# Altium schematic sheet FPGA.SchDoc
size A2; PageSetup: Record=PageOptions|CenterHorizontal=True|CenterVertical=True|PrintScale=0.70|XCorrection=1.00|YCorrection=1.00|PrintKind=1|BorderSize=5000000|LeftOffset=0|BottomOffset=0|Orientation=2|PaperLength=2970|PaperWidth=2100|Scale=100|PaperSource=1|PrintQuality=600|MediaType=1|DitherType=10|PaperKind=A4|PrintScaleMode=1
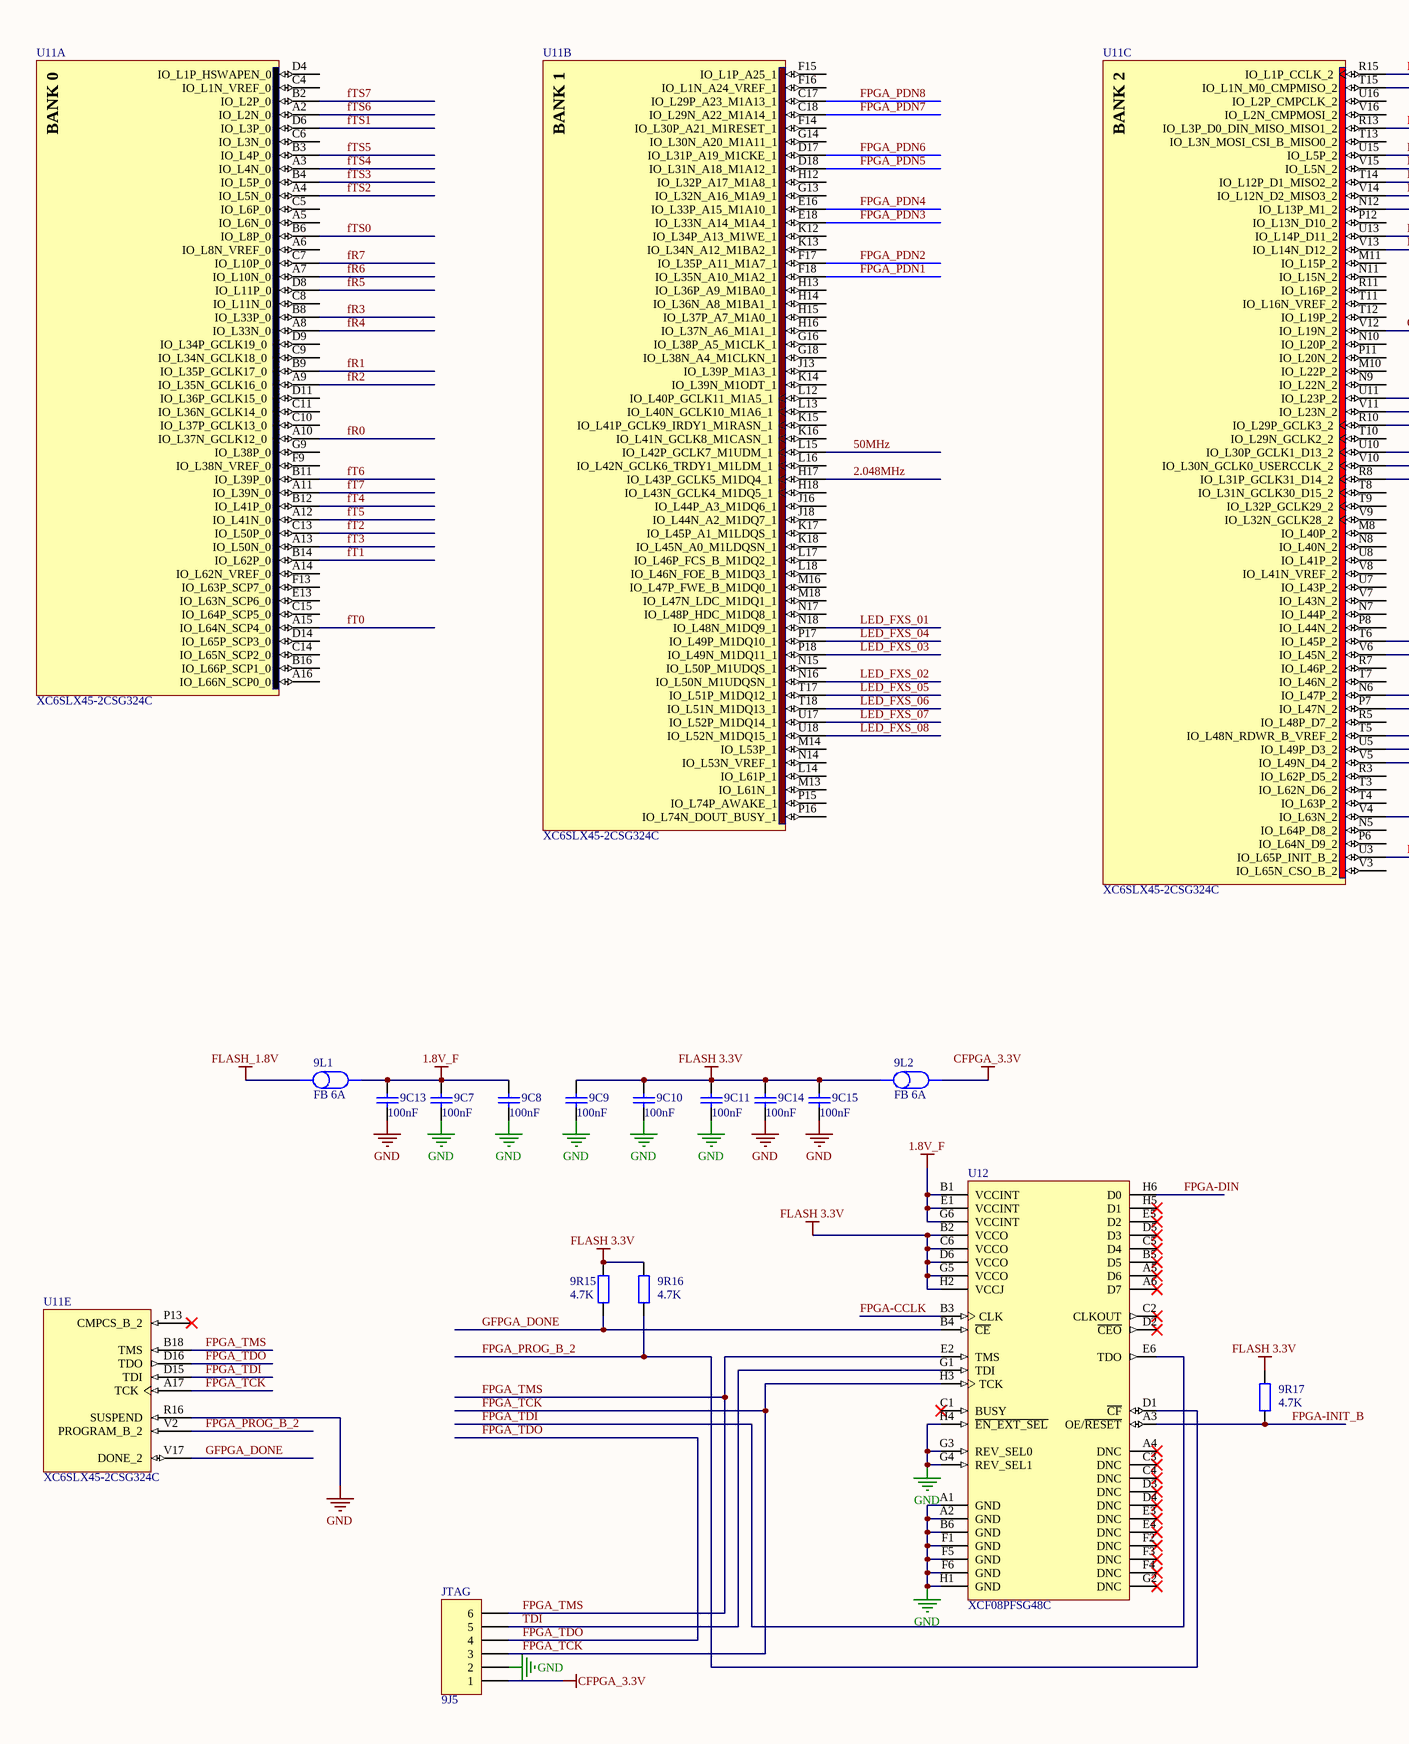
[diagram p0: FPGA.SchDoc, left]
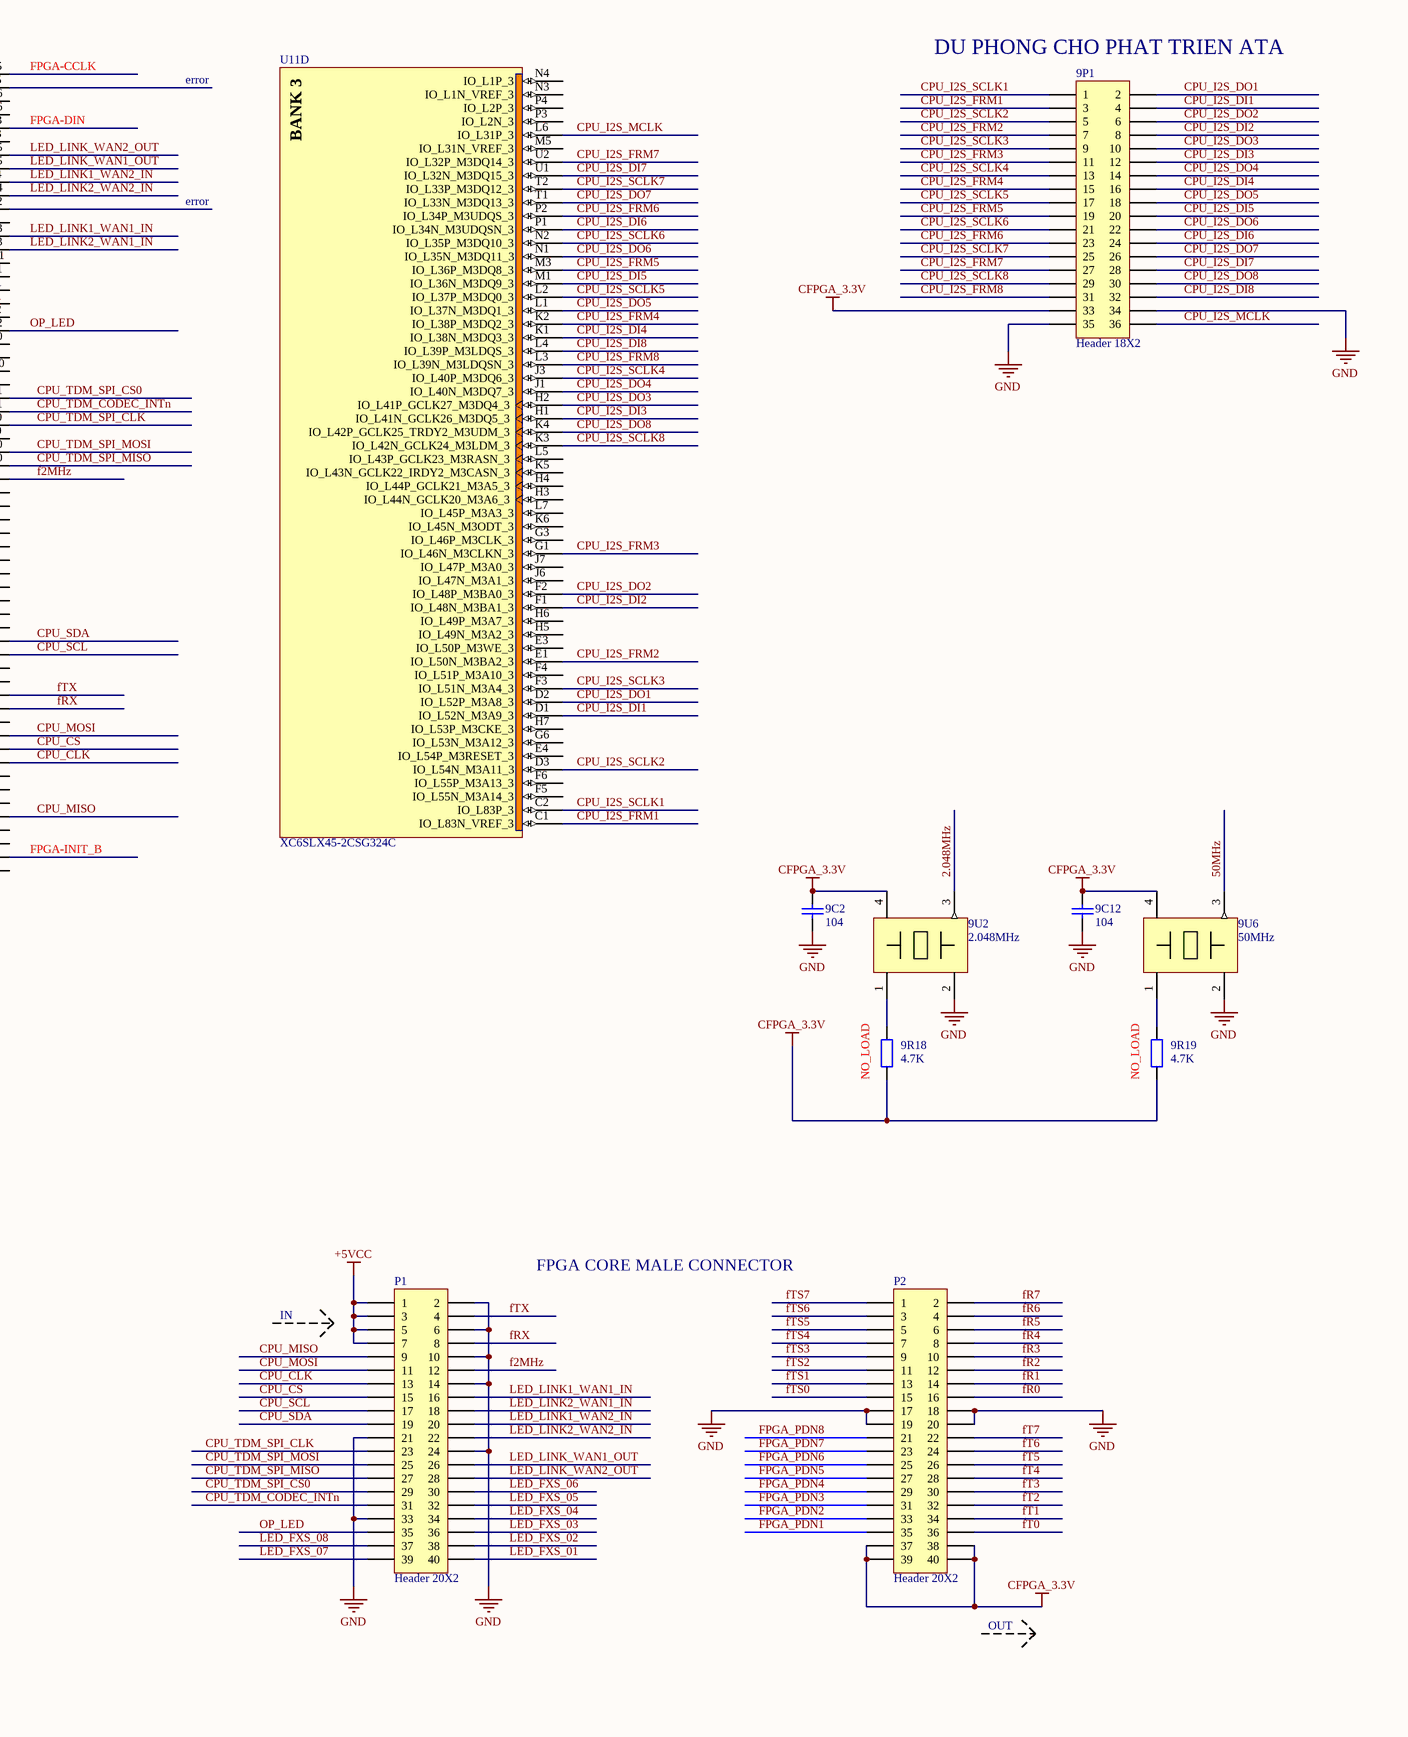
[diagram p1: FPGA.SchDoc, right]

## Parts
9C2  CAP: 104  [0805C]  (hidden comment: CAP1)
9C7  100nF  [C0402]
9C8  100nF  [C0402]
9C9  100nF  [C0402]
9C10  100nF  [C0402]
9C11  100nF  [C0402]
9C12  CAP: 104  [0805C]  (hidden comment: CAP1)
9C13  100nF  [C0402]
9C14  100nF  [C0402]
9C15  100nF  [C0402]
9J5  JTAG  [HDR 1X6]
9L1  FB 6A  [0805]
9L2  FB 6A  [0805]
9P1  Header 18X2  [HDR2X18]
9R15  4.7K  [0603_1]
9R16  4.7K  [0603_1]
9R17  4.7K  [0603_1]
9R18  4.7K  LOAD: NO_LOAD  [0603_1]
9R19  4.7K  LOAD: NO_LOAD  [0603_1]
9U2  2.048MHz  [CB3LV-3I-2M0480]
9U6  50MHz  [CB3LV-3I-2M0480]
P1  Header 20X2  [HEADER 40P MALE]
P2  Header 20X2  [HEADER 40P MALE]
U11  XC6SLX45-2CSG324C  [CSG324]  (parts A,B,C,D,E of 8)
U12  XCF08PFSG48C  [XCF08PFSG48C]

## Nets
1.8V_F: 9C7.2 9C8.2 9C13.2 9L1.1 U12.B1(VCCINT) U12.E1(VCCINT) U12.G6(VCCINT)
+5VCC: P1.1 P1.3 P1.5 P1.7
CFPGA_3.3V: 9C2.2 9C12.2 9J5.1 9L2.1 9P1.33 9R18.1 9R19.1 9U2.4 9U6.4 P2.37 P2.38 P2.39 P2.40
FLASH 3.3V: 9C9.2 9C10.2 9C11.2 9C14.2 9C15.2 9L2.2 9R15.2 9R16.2 9R17.2 U12.B2(VCCO) U12.C6(VCCO) U12.D6(VCCO) U12.G5(VCCO) U12.H2(VCCJ)
FLASH_1.8V: 9L1.2
GND: 9C2.1 9C7.1 9C8.1 9C9.1 9C10.1 9C11.1 9C12.1 9C13.1 9C14.1 9C15.1 9J5.2 9P1.34 9P1.35 9U2.2 9U6.2 P1.2 P1.6 P1.10 P1.14 P1.21 P1.24 P1.33 P2.17 P2.18 P2.19 P2.20 U11.R16(SUSPEND) U12.A1(GND) U12.A2(GND) U12.B6(GND) U12.F1(GND) U12.F5(GND) U12.F6(GND) U12.G3(REV_SEL0) U12.G4(REV_SEL1) U12.H1(GND) U12.H4(~{EN_EXT_SEL})
2.048MHz: 9U2.3 U11.H17(IO_L43P_GCLK5_M1DQ4_1)
50MHz: 9U6.3 U11.L15(IO_L42P_GCLK7_M1UDM_1)
CPU_CLK: P1.13 U11.V5(IO_L49N_D4_2)
CPU_CS: P1.15 U11.U5(IO_L49P_D3_2)
CPU_I2S_DI1: 9P1.4 U11.D1(IO_L52N_M3A9_3)
CPU_I2S_DI2: 9P1.8 U11.F1(IO_L48N_M3BA1_3)
CPU_I2S_DI3: 9P1.12 U11.H1(IO_L41N_GCLK26_M3DQ5_3)
CPU_I2S_DI4: 9P1.16 U11.K1(IO_L38N_M3DQ3_3)
CPU_I2S_DI5: 9P1.20 U11.M1(IO_L36N_M3DQ9_3)
CPU_I2S_DI6: 9P1.24 U11.P1(IO_L34N_M3UDQSN_3)
CPU_I2S_DI7: 9P1.28 U11.U1(IO_L32N_M3DQ15_3)
CPU_I2S_DI8: 9P1.32 U11.L4(IO_L39P_M3LDQS_3)
CPU_I2S_DO1: 9P1.2 U11.D2(IO_L52P_M3A8_3)
CPU_I2S_DO2: 9P1.6 U11.F2(IO_L48P_M3BA0_3)
CPU_I2S_DO3: 9P1.10 U11.H2(IO_L41P_GCLK27_M3DQ4_3)
CPU_I2S_DO4: 9P1.14 U11.J1(IO_L40N_M3DQ7_3)
CPU_I2S_DO5: 9P1.18 U11.L1(IO_L37N_M3DQ1_3)
CPU_I2S_DO6: 9P1.22 U11.N1(IO_L35N_M3DQ11_3)
CPU_I2S_DO7: 9P1.26 U11.T1(IO_L33N_M3DQ13_3)
CPU_I2S_DO8: 9P1.30 U11.K4(IO_L42P_GCLK25_TRDY2_M3UDM_3)
CPU_I2S_FRM1: 9P1.3 U11.C1(IO_L83N_VREF_3)
CPU_I2S_FRM2: 9P1.7 U11.E1(IO_L50N_M3BA2_3)
CPU_I2S_FRM3: 9P1.11 U11.G1(IO_L46N_M3CLKN_3)
CPU_I2S_FRM4: 9P1.15 U11.K2(IO_L38P_M3DQ2_3)
CPU_I2S_FRM5: 9P1.19 U11.M3(IO_L36P_M3DQ8_3)
CPU_I2S_FRM6: 9P1.23 U11.P2(IO_L34P_M3UDQS_3)
CPU_I2S_FRM7: 9P1.27 U11.U2(IO_L32P_M3DQ14_3)
CPU_I2S_FRM8: 9P1.31 U11.L3(IO_L39N_M3LDQSN_3)
CPU_I2S_MCLK: 9P1.36 U11.L6(IO_L31P_3)
CPU_I2S_SCLK1: 9P1.1 U11.C2(IO_L83P_3)
CPU_I2S_SCLK2: 9P1.5 U11.D3(IO_L54N_M3A11_3)
CPU_I2S_SCLK3: 9P1.9 U11.F3(IO_L51N_M3A4_3)
CPU_I2S_SCLK4: 9P1.13 U11.J3(IO_L40P_M3DQ6_3)
CPU_I2S_SCLK5: 9P1.17 U11.L2(IO_L37P_M3DQ0_3)
CPU_I2S_SCLK6: 9P1.21 U11.N2(IO_L35P_M3DQ10_3)
CPU_I2S_SCLK7: 9P1.25 U11.T2(IO_L33P_M3DQ12_3)
CPU_I2S_SCLK8: 9P1.29 U11.K3(IO_L42N_GCLK24_M3LDM_3)
CPU_MISO: P1.9 U11.V4(IO_L63N_2)
CPU_MOSI: P1.11 U11.T5(IO_L48N_RDWR_B_VREF_2)
CPU_SCL: P1.17 U11.V6(IO_L45N_2)
CPU_SDA: P1.19 U11.T6(IO_L45P_2)
CPU_TDM_CODEC_INTn: P1.31 U11.V11(IO_L23N_2)
CPU_TDM_SPI_CLK: P1.23 U11.R10(IO_L29P_GCLK3_2)
CPU_TDM_SPI_CS0: P1.29 U11.U11(IO_L23P_2)
CPU_TDM_SPI_MISO: P1.27 U11.V10(IO_L30N_GCLK0_USERCCLK_2)
CPU_TDM_SPI_MOSI: P1.25 U11.U10(IO_L30P_GCLK1_D13_2)
f2MHz: P1.12 U11.R8(IO_L31P_GCLK31_D14_2)
FPGA-CCLK: U11.R15(IO_L1P_CCLK_2) U12.B3(CLK)
FPGA-DIN: U11.R13(IO_L3P_D0_DIN_MISO_MISO1_2) U12.H6(D0)
FPGA-INIT_B: 9R17.1 U11.U3(IO_L65P_INIT_B_2) U12.A3(OE/~{RESET})
FPGA_PDN1: P2.35 U11.F18(IO_L35N_A10_M1A2_1)
FPGA_PDN2: P2.33 U11.F17(IO_L35P_A11_M1A7_1)
FPGA_PDN3: P2.31 U11.E18(IO_L33N_A14_M1A4_1)
FPGA_PDN4: P2.29 U11.E16(IO_L33P_A15_M1A10_1)
FPGA_PDN5: P2.27 U11.D18(IO_L31N_A18_M1A12_1)
FPGA_PDN6: P2.25 U11.D17(IO_L31P_A19_M1CKE_1)
FPGA_PDN7: P2.23 U11.C18(IO_L29N_A22_M1A14_1)
FPGA_PDN8: P2.21 U11.C17(IO_L29P_A23_M1A13_1)
FPGA_PROG_B_2: 9R16.1 U11.V2(PROGRAM_B_2) U12.D1(~{CF})
FPGA_TCK: 9J5.3 U11.A17(TCK) U12.H3(TCK)
FPGA_TDI: U11.D15(TDI) U12.E6(TDO)
FPGA_TDO: 9J5.4 U11.D16(TDO)
FPGA_TMS: 9J5.6 U11.B18(TMS) U12.E2(TMS)
fR0: P2.16 U11.A10(IO_L37N_GCLK12_0)
fR1: P2.14 U11.B9(IO_L35P_GCLK17_0)
fR2: P2.12 U11.A9(IO_L35N_GCLK16_0)
fR3: P2.10 U11.B8(IO_L33P_0)
fR4: P2.8 U11.A8(IO_L33N_0)
fR5: P2.6 U11.D8(IO_L11P_0)
fR6: P2.4 U11.A7(IO_L10N_0)
fR7: P2.2 U11.C7(IO_L10P_0)
fRX: P1.8 U11.P7(IO_L47N_2)
fT0: P2.36 U11.A15(IO_L64N_SCP4_0)
fT1: P2.34 U11.B14(IO_L62P_0)
fT2: P2.32 U11.C13(IO_L50P_0)
fT3: P2.30 U11.A13(IO_L50N_0)
fT4: P2.28 U11.B12(IO_L41P_0)
fT5: P2.26 U11.A12(IO_L41N_0)
fT6: P2.24 U11.B11(IO_L39P_0)
fT7: P2.22 U11.A11(IO_L39N_0)
fTS0: P2.15 U11.B6(IO_L8P_0)
fTS1: P2.13 U11.D6(IO_L3P_0)
fTS2: P2.11 U11.A4(IO_L5N_0)
fTS3: P2.9 U11.B4(IO_L5P_0)
fTS4: P2.7 U11.A3(IO_L4N_0)
fTS5: P2.5 U11.B3(IO_L4P_0)
fTS6: P2.3 U11.A2(IO_L2N_0)
fTS7: P2.1 U11.B2(IO_L2P_0)
fTX: P1.4 U11.N6(IO_L47P_2)
GFPGA_DONE: 9R15.1 U11.V17(DONE_2) U12.B4(~{CE})
LED_FXS_01: P1.40 U11.N18(IO_L48N_M1DQ9_1)
LED_FXS_02: P1.38 U11.N16(IO_L50N_M1UDQSN_1)
LED_FXS_03: P1.36 U11.P18(IO_L49N_M1DQ11_1)
LED_FXS_04: P1.34 U11.P17(IO_L49P_M1DQ10_1)
LED_FXS_05: P1.32 U11.T17(IO_L51P_M1DQ12_1)
LED_FXS_06: P1.30 U11.T18(IO_L51N_M1DQ13_1)
LED_FXS_07: P1.39 U11.U17(IO_L52P_M1DQ14_1)
LED_FXS_08: P1.37 U11.U18(IO_L52N_M1DQ15_1)
LED_LINK1_WAN1_IN: P1.16 U11.U13(IO_L14P_D11_2)
LED_LINK1_WAN2_IN: P1.20 U11.T14(IO_L12P_D1_MISO2_2)
LED_LINK2_WAN1_IN: P1.18 U11.V13(IO_L14N_D12_2)
LED_LINK2_WAN2_IN: P1.22 U11.V14(IO_L12N_D2_MISO3_2)
LED_LINK_WAN1_OUT: P1.26 U11.V15(IO_L5N_2)
LED_LINK_WAN2_OUT: P1.28 U11.U15(IO_L5P_2)
OP_LED: P1.35 U11.V12(IO_L19N_2)
TDI: 9J5.5 U12.G1(TDI)
Net9R18_2: 9R18.2 9U2.1
Net9R19_2: 9R19.2 9U6.1

Not connected (* = marked no-connect by the designer): U11 A5(IO_L6N_0) A6(IO_L8N_VREF_0) A14(IO_L62N_VREF_0) A16(IO_L66N_SCP0_0) B16(IO_L66P_SCP1_0) C4(IO_L1N_VREF_0) C5(IO_L6P_0) C6(IO_L3N_0) C8(IO_L11N_0) C9(IO_L34N_GCLK18_0) C10(IO_L37P_GCLK13_0) C11(IO_L36N_GCLK14_0) C14(IO_L65N_SCP2_0) C15(IO_L64P_SCP5_0) D4(IO_L1P_HSWAPEN_0) D9(IO_L34P_GCLK19_0) D11(IO_L36P_GCLK15_0) D14(IO_L65P_SCP3_0) E3(IO_L50P_M3WE_3) E4(IO_L54P_M3RESET_3) E13(IO_L63N_SCP6_0) F4(IO_L51P_M3A10_3) F5(IO_L55N_M3A14_3) F6(IO_L55P_M3A13_3) F9(IO_L38N_VREF_0) F13(IO_L63P_SCP7_0) F14(IO_L30P_A21_M1RESET_1) F15(IO_L1P_A25_1) F16(IO_L1N_A24_VREF_1) G3(IO_L46P_M3CLK_3) G6(IO_L53N_M3A12_3) G9(IO_L38P_0) G13(IO_L32N_A16_M1A9_1) G14(IO_L30N_A20_M1A11_1) G16(IO_L38P_A5_M1CLK_1) G18(IO_L38N_A4_M1CLKN_1) H3(IO_L44N_GCLK20_M3A6_3) H4(IO_L44P_GCLK21_M3A5_3) H5(IO_L49N_M3A2_3) H6(IO_L49P_M3A7_3) H7(IO_L53P_M3CKE_3) H12(IO_L32P_A17_M1A8_1) H13(IO_L36P_A9_M1BA0_1) H14(IO_L36N_A8_M1BA1_1) H15(IO_L37P_A7_M1A0_1) H16(IO_L37N_A6_M1A1_1) H18(IO_L43N_GCLK4_M1DQ5_1) J6(IO_L47N_M3A1_3) J7(IO_L47P_M3A0_3) J13(IO_L39P_M1A3_1) J16(IO_L44P_A3_M1DQ6_1) J18(IO_L44N_A2_M1DQ7_1) K5(IO_L43N_GCLK22_IRDY2_M3CASN_3) K6(IO_L45N_M3ODT_3) K12(IO_L34P_A13_M1WE_1) K13(IO_L34N_A12_M1BA2_1) K14(IO_L39N_M1ODT_1) K15(IO_L41P_GCLK9_IRDY1_M1RASN_1) K16(IO_L41N_GCLK8_M1CASN_1) K17(IO_L45P_A1_M1LDQS_1) K18(IO_L45N_A0_M1LDQSN_1) L5(IO_L43P_GCLK23_M3RASN_3) L7(IO_L45P_M3A3_3) L12(IO_L40P_GCLK11_M1A5_1) L13(IO_L40N_GCLK10_M1A6_1) L14(IO_L61P_1) L16(IO_L42N_GCLK6_TRDY1_M1LDM_1) L17(IO_L46P_FCS_B_M1DQ2_1) L18(IO_L46N_FOE_B_M1DQ3_1) M5(IO_L31N_VREF_3) M8(IO_L40P_2) M10(IO_L22P_2) M11(IO_L15P_2) M13(IO_L61N_1) M14(IO_L53P_1) M16(IO_L47P_FWE_B_M1DQ0_1) M18(IO_L47N_LDC_M1DQ1_1) N3(IO_L1N_VREF_3) N4(IO_L1P_3) N5(IO_L64P_D8_2) N7(IO_L44P_2) N8(IO_L40N_2) N9(IO_L22N_2) N10(IO_L20P_2) N11(IO_L15N_2) N12(IO_L13P_M1_2) N14(IO_L53N_VREF_1) N15(IO_L50P_M1UDQS_1) N17(IO_L48P_HDC_M1DQ8_1) P3(IO_L2N_3) P4(IO_L2P_3) P6(IO_L64N_D9_2) P8(IO_L44N_2) P11(IO_L20N_2) P12(IO_L13N_D10_2) P13(CMPCS_B_2)* P15(IO_L74P_AWAKE_1) P16(IO_L74N_DOUT_BUSY_1) R3(IO_L62P_D5_2) R5(IO_L48P_D7_2) R7(IO_L46P_2) R11(IO_L16P_2) T3(IO_L62N_D6_2) T4(IO_L63P_2) T7(IO_L46N_2) T8(IO_L31N_GCLK30_D15_2) T9(IO_L32P_GCLK29_2) T10(IO_L29N_GCLK2_2) T11(IO_L16N_VREF_2) T12(IO_L19P_2) T13(IO_L3N_MOSI_CSI_B_MISO0_2) T15(IO_L1N_M0_CMPMISO_2) U7(IO_L43P_2) U8(IO_L41P_2) U16(IO_L2P_CMPCLK_2) V3(IO_L65N_CSO_B_2) V7(IO_L43N_2) V8(IO_L41N_VREF_2) V9(IO_L32N_GCLK28_2) V16(IO_L2N_CMPMOSI_2); U12 A4(DNC)* A5(D6)* A6(D7)* B5(D5)* C1(BUSY)* C2(CLKOUT)* C3(DNC)* C4(DNC)* C5(D4)* D2(~{CEO})* D3(DNC)* D4(DNC)* D5(D3)* E3(DNC)* E4(DNC)* E5(D2)* F2(DNC)* F3(DNC)* F4(DNC)* G2(DNC)* H5(D1)*

## Notes on the sheet
- (near 9P1) DU PHONG CHO PHAT TRIEN ATA
- error
- FPGA CORE MALE CONNECTOR
- IN
- OUT
- (in symbol XC6SLX45-2CSG324C, part A) BANK 0
- (in symbol XC6SLX45-2CSG324C, part B) BANK 1
- (in symbol XC6SLX45-2CSG324C, part C) BANK 2
- (in symbol XC6SLX45-2CSG324C, part D) BANK 3

## Library data of the parts
9C7-9C11 9C13-9C15 = CAP: CAP CER 10V 10% 0402
9J5 = J6x1: CONNECTOR HEADER 1x6 PITCH 2.54
9L1 9L2 = FB: FERRITE BEAD 22 OHM 0805 1LN; PART_NUMBER: BLM21PG220SN1D; MANUFACTURE: Assembly House; NO_LOAD: LOAD
9P1 = Header 18X2: Header, 18-Pin, Dual row; LatestRevisionDate: 17-Jul-2002; LatestRevisionNote: Re-released for DXP Platform.; Publisher: Altium Limited
9R15-9R19 = RES: RES 1/8W 5% 0603
9U2 = CRYSTAL2
9U6 = CRYSTAL2: LOAD: NO_LOAD
P1 P2 = Header 20X2: Header, 20-Pin, Dual row; LatestRevisionDate: 17-Jul-2002; LatestRevisionNote: Re-released for DXP Platform.; Publisher: Altium Limited
U11 = XC6SLX45-2CSG324C: Spartan-6 LX 1.2V FPGA, 218 User I/Os, 324-Ball Chip-Scale BGA (0.8mm Pitch), Speed Grade 2, Commercial Grade, Pb-Free; Published: 17-Nov-2009; DatasheetVersion: ver1.6, Nov-2010; PackageVersion: ver1.1, Nov-2009; PackageReference: CSG324; Publisher: Altium Limited; PackageDescription: 324-Ball Chip-Scale BGA (CSG324) Package, 0.8 mm Pitch; Supplier 1: Farnell; Supplier Part Number 1: 1762496; Code_JEDEC: MO-275-KKAC-1; ComponentLink1Description: Manufacturer Link; ComponentLink1URL: http://www.xilinx.com; ComponentLink2Description: Spartan-6 Datasheet; ComponentLink2URL: http://www.xilinx.com/support/documentation/data_sheets/ds160.pdf; ComponentLink3Description: Spartan-6 Documents; ComponentLink3URL: http://www.xilinx.com/support/documentation/spartan-6.htm; ComponentLink4Description: Xilinx.com Home; ComponentLink4URL: http://www.xilinx.com
U12 = XCF08PFSG48C: XCF00P Series, Platform Flash In-System Programmable Configuration 1.8V PROM, 48 Ball BGA, 8-Megabit, Commercial Grade, Pb-Free; FirstPublished: 4-Mar-2005; LatestRevisionDate: 16-Nov-2009; LatestRevisionNote: Updated to datasheet version 2.17, Oct-2009.; DatasheetVersion: ver2.17, Oct-2009; PackageVersion: ver1.0.1, Apr-2005; PackageReference: FSG48; Publisher: Altium Limited; PackageDescription: 48-Ball Chip Scale Ball Grid Array 0.8 mm Pitch (FSG48) - Pb-Free; Supplier 1: Digi-Key; Supplier Part Number 1: 122-1453-ND; Code_JEDEC: MO-210-AD; ComponentLink1Description: Platform Flash Datasheet; ComponentLink1URL: http://www.xilinx.com/support/documentation/data_sheets/ds123.pdf; ComponentLink2Description: FSG48 Package Drawing; ComponentLink2URL: http://www.xilinx.com/support/documentation/package_specs/fs48.pdf; ComponentLink3Description: Configuration PROM Documents; ComponentLink3URL: http://www.xilinx.com/support/documentation/configuration_proms.htm; ComponentLink4Description: Xilinx.com Home; ComponentLink4URL: http://www.xilinx.com